# EAGLE schematic RT5350F_OLinuXino_Rev_B (EAGLE 4.16)
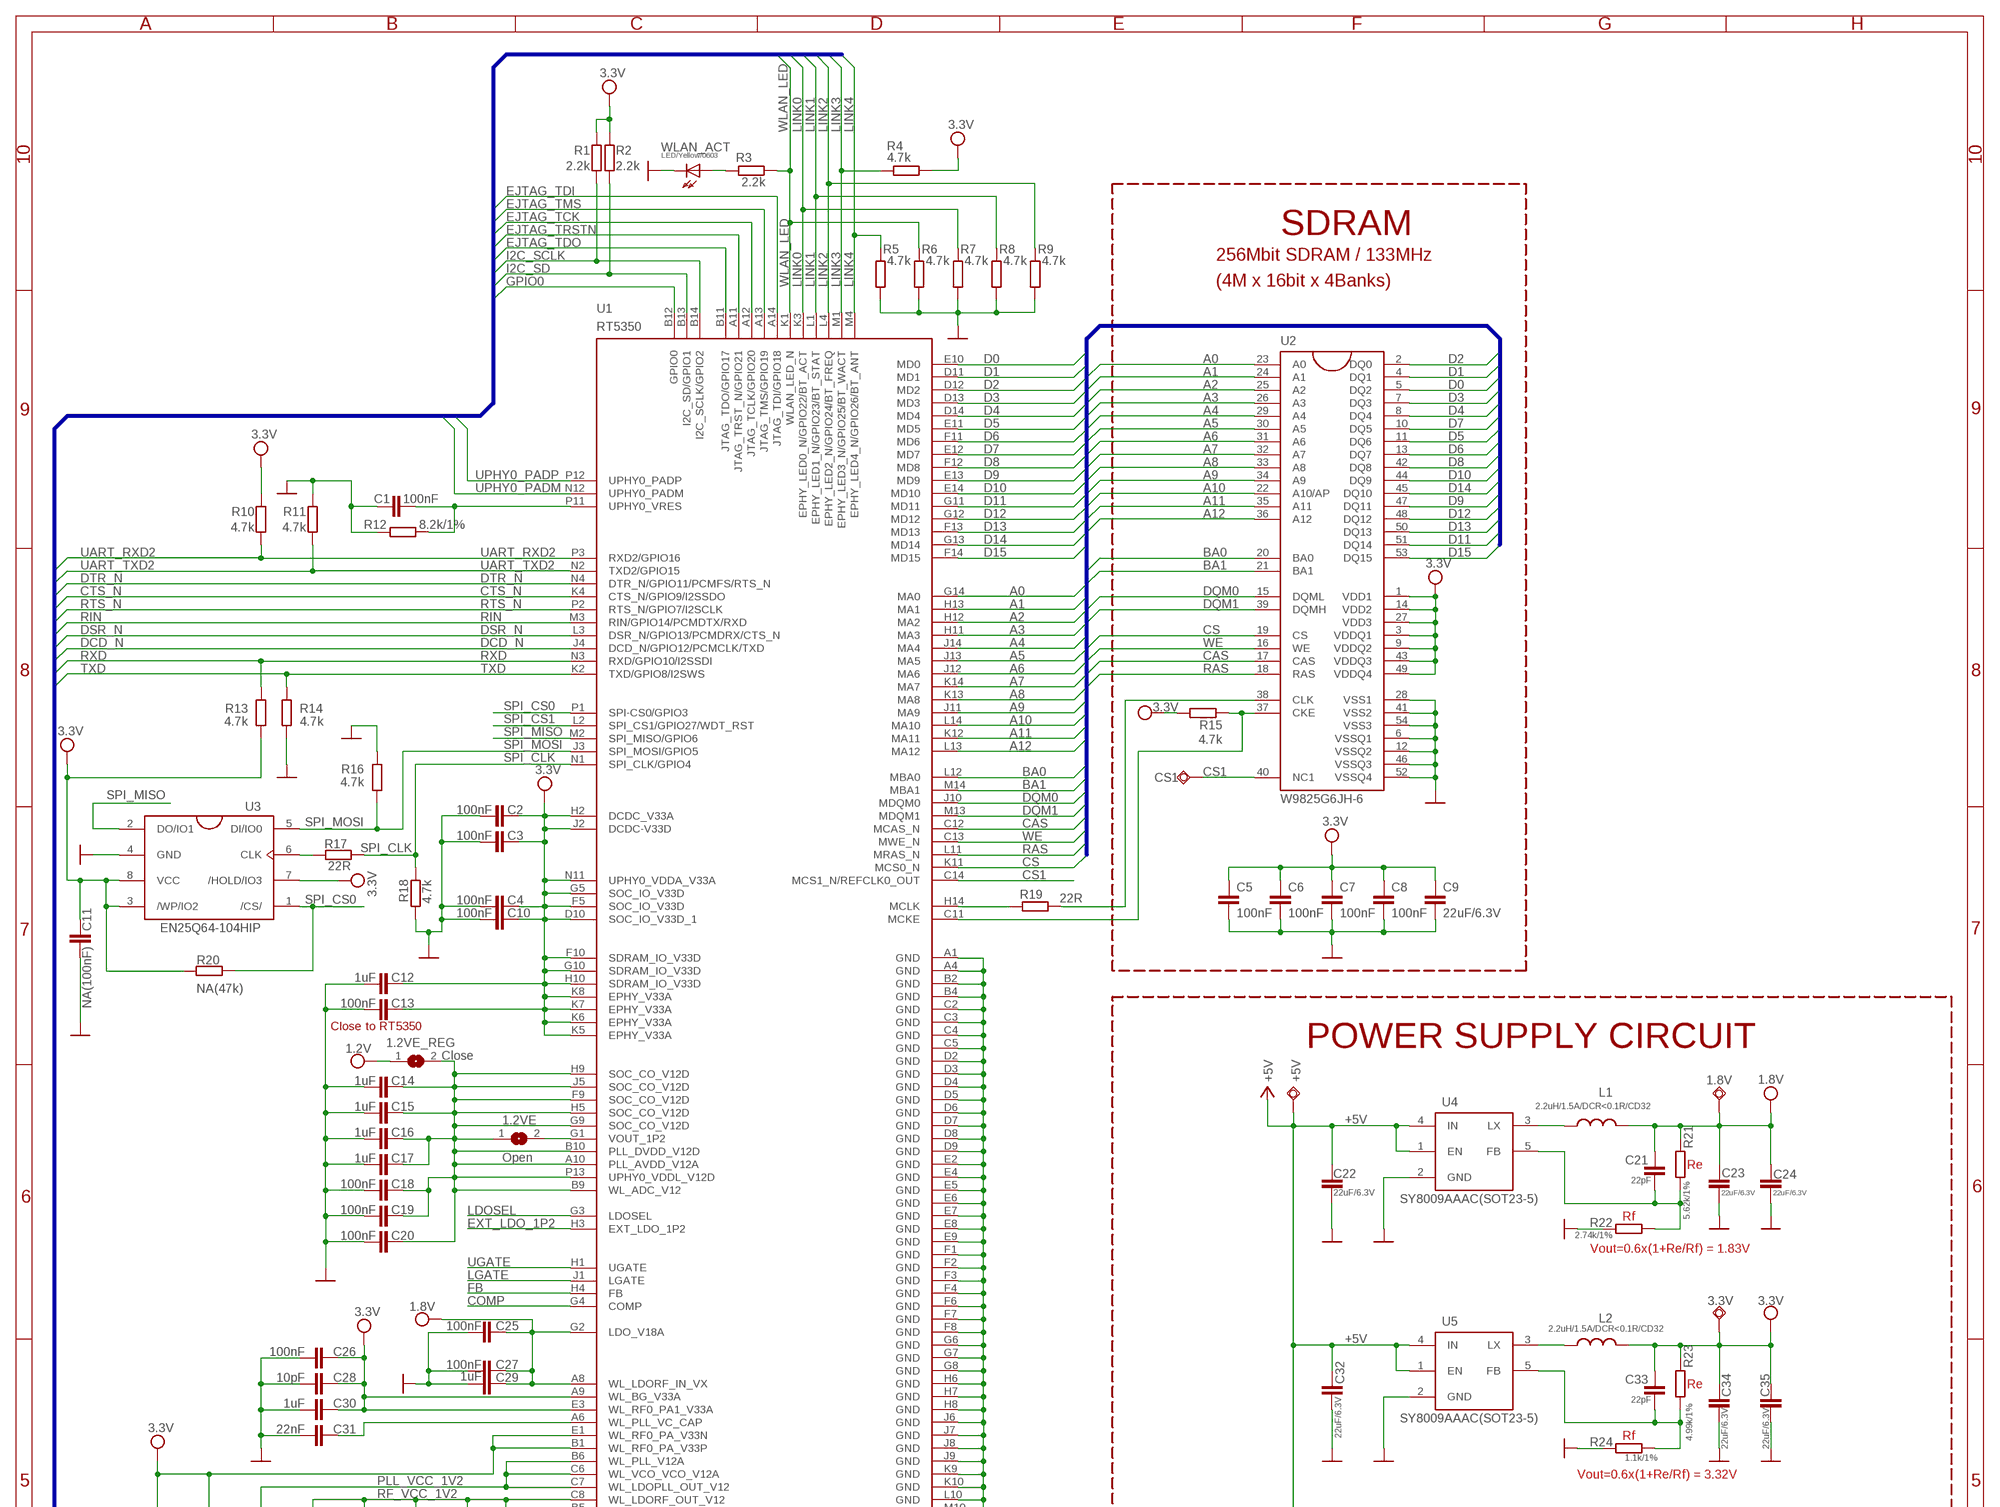
[diagram p0: schematic, sheet 1, part 1 of 2]
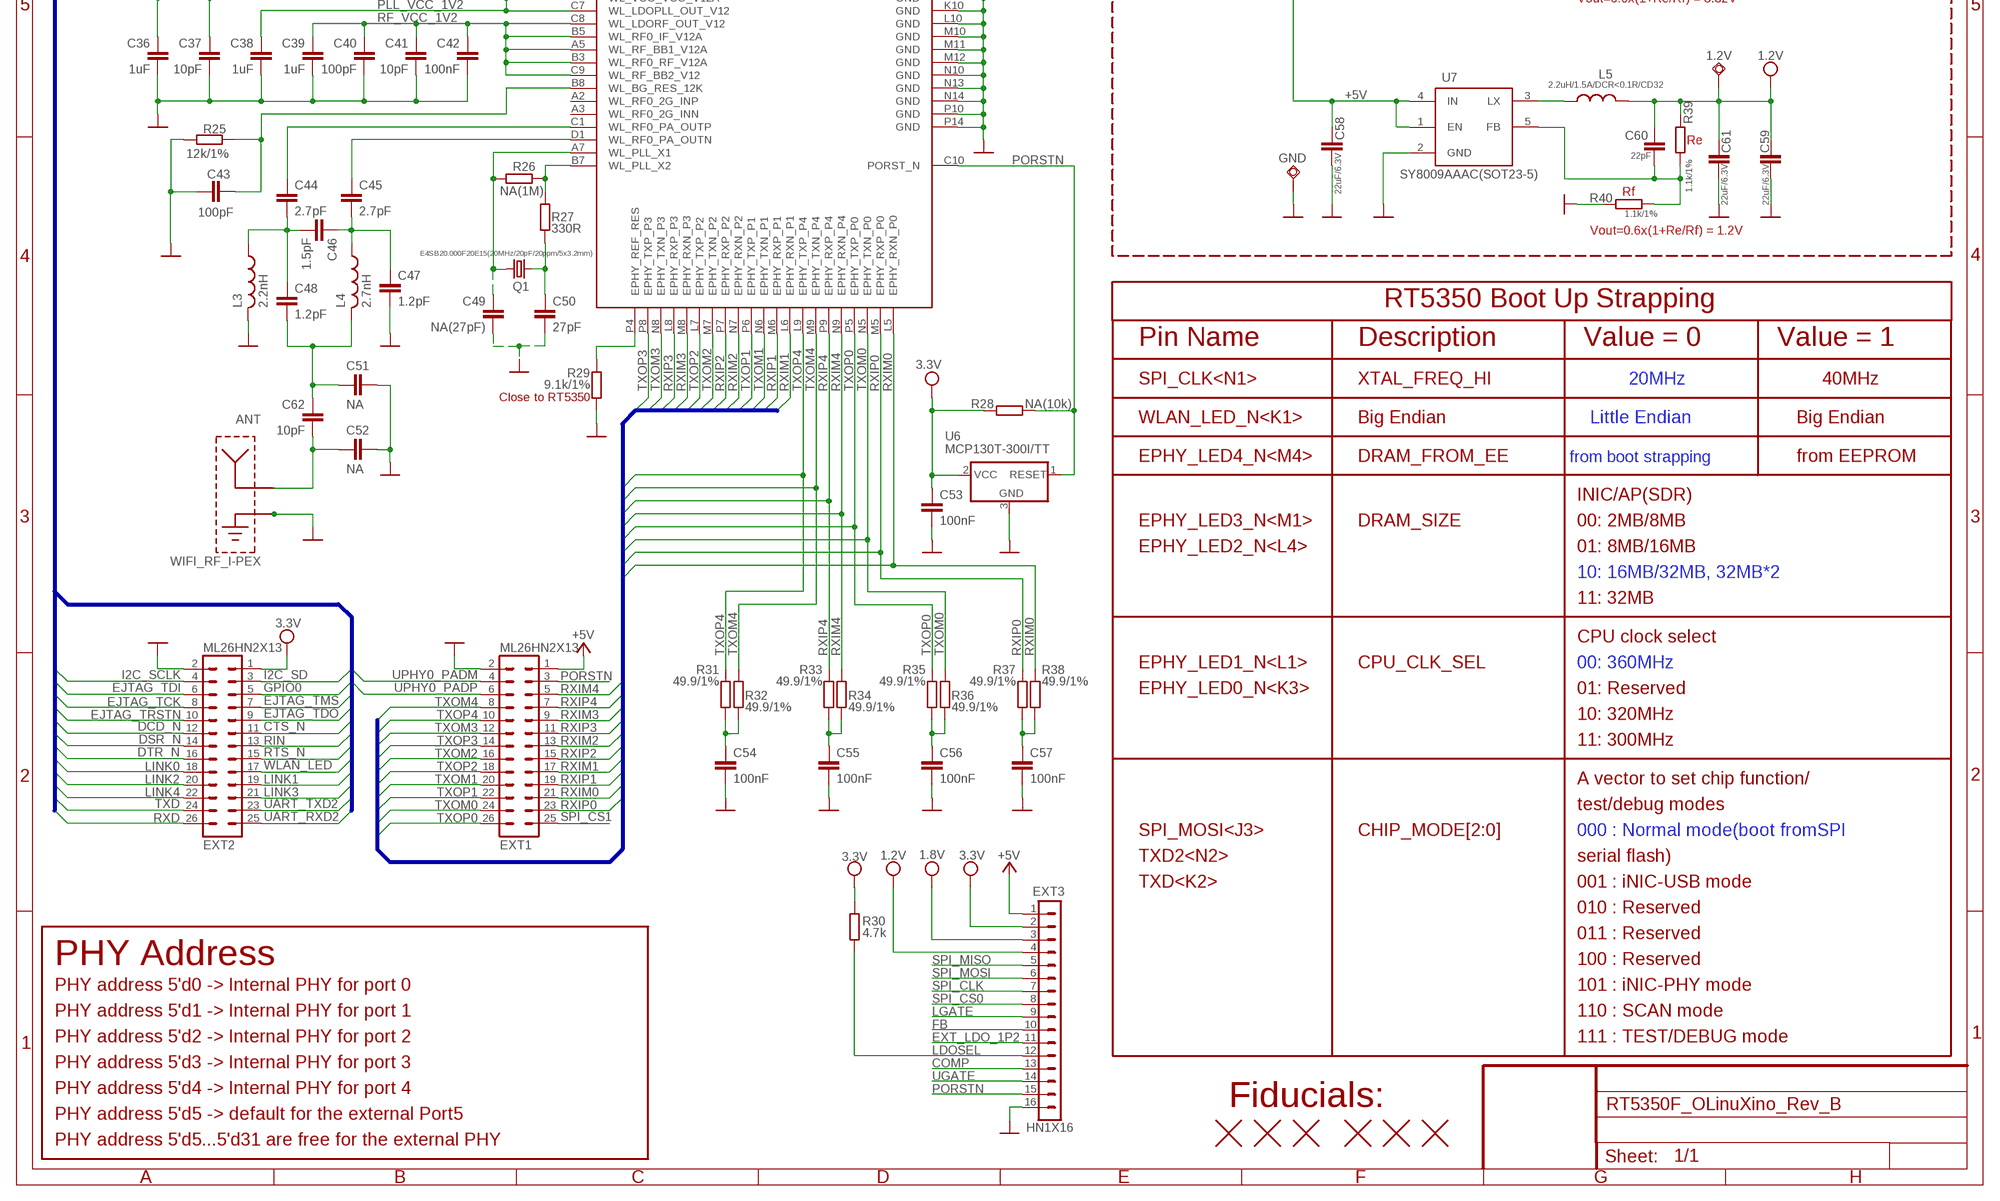
[diagram p1: schematic, sheet 1, part 2 of 2]

## Parts
1.2V  TESTPADTESTPAD_40-ROUND  [TESTPAD_40-ROUND]
1.2VE  Open  SJ_SMALLER  [SJ_1_SMALLER]
1.2VE_REG  Close  SJ_SMALLER  [SJ_1_SMALLER]
1.8V  TESTPADTESTPAD_40-ROUND  [TESTPAD_40-ROUND]
3.3V  3.3V  TESTPADTESTPAD_40-ROUND  [TESTPAD_40-ROUND]
+5V  TESTPADTESTPAD_40-ROUND  [TESTPAD_40-ROUND]
ANT  WIFI_RF_I-PEX  [WIFI_RF]
C1  100nF  C-EUC0402_TI  [C0402_TI]
C2  100nF  C-EUC0402_TI  [C0402_TI]
C3  100nF  C-EUC0402_TI  [C0402_TI]
C4  100nF  C-EUC0402_TI  [C0402_TI]
C5  100nF  C-EUC0402_TI  [C0402_TI]
C6  100nF  C-EUC0402_TI  [C0402_TI]
C7  100nF  C-EUC0402_TI  [C0402_TI]
C8  100nF  C-EUC0402_TI  [C0402_TI]
C9  22uF/6.3V  C-EUC0603_DWS  [C0603_DWS]
C10  100nF  C-EUC0402_TI  [C0402_TI]
C11  NA(100nF)  C-EUC0402_TI  [C0402_TI]
C12  1uF  C-EUC0603_DWS  [C0603_DWS]
C13  100nF  C-EUC0402_TI  [C0402_TI]
C14  1uF  C-EUC0603_DWS  [C0603_DWS]
C15  1uF  C-EUC0603_DWS  [C0603_DWS]
C16  1uF  C-EUC0603_DWS  [C0603_DWS]
C17  1uF  C-EUC0603_DWS  [C0603_DWS]
C18  100nF  C-EUC0402_TI  [C0402_TI]
C19  100nF  C-EUC0402_TI  [C0402_TI]
C20  100nF  C-EUC0402_TI  [C0402_TI]
C21  22pF  C-EUC0603_DWS  [C0603_DWS]
C22  22uF/6.3V  C-EUC0603_DWS  [C0603_DWS]
C23  22uF/6.3V  C-EUC0603_DWS  [C0603_DWS]
C24  22uF/6.3V  C-EUC0603_DWS  [C0603_DWS]
C25  100nF  C-EUC0402_TI  [C0402_TI]
C26  100nF  C-EUC0402_TI  [C0402_TI]
C27  100nF  C-EUC0402_TI  [C0402_TI]
C28  10pF  C-EUC0402_TI  [C0402_TI]
C29  1uF  C-EUC0603_DWS  [C0603_DWS]
C30  1uF  C-EUC0603_DWS  [C0603_DWS]
C31  22nF  C-EUC0402_TI  [C0402_TI]
C32  22uF/6.3V  C-EUC0603_DWS  [C0603_DWS]
C33  22pF  C-EUC0603_DWS  [C0603_DWS]
C34  22uF/6.3V  C-EUC0603_DWS  [C0603_DWS]
C35  22uF/6.3V  C-EUC0603_DWS  [C0603_DWS]
C36  1uF  C-EUC0603_DWS  [C0603_DWS]
C37  10pF  C-EUC0402_TI  [C0402_TI]
C38  1uF  C-EUC0603_DWS  [C0603_DWS]
C39  1uF  C-EUC0603_DWS  [C0603_DWS]
C40  100pF  C-EUC0402_TI  [C0402_TI]
C41  10pF  C-EUC0402_TI  [C0402_TI]
C42  100nF  C-EUC0402_TI  [C0402_TI]
C43  100pF  C-EUC0402_TI  [C0402_TI]
C44  2.7pF  C-EUC0402_TI  [C0402_TI]
C45  2.7pF  C-EUC0402_TI  [C0402_TI]
C46  1.5pF  C-EUC0402_TI  [C0402_TI]
C47  1.2pF  C-EUC0402_TI  [C0402_TI]
C48  1.2pF  C-EUC0402_TI  [C0402_TI]
C49  NA(27pF)  C-EUC0603_DWS  [C0603_DWS]
C50  27pF  C-EUC0603_DWS  [C0603_DWS]
C51  NA  C-EUC0402_TI  [C0402_TI]
C52  NA  C-EUC0402_TI  [C0402_TI]
C53  100nF  C-EUC0402_TI  [C0402_TI]
C54  100nF  C-EUC0402_TI  [C0402_TI]
C55  100nF  C-EUC0402_TI  [C0402_TI]
C56  100nF  C-EUC0402_TI  [C0402_TI]
C57  100nF  C-EUC0402_TI  [C0402_TI]
C58  22uF/6.3V  C-EUC0603_DWS  [C0603_DWS]
C59  22uF/6.3V  C-EUC0603_DWS  [C0603_DWS]
C60  22pF  C-EUC0603_DWS  [C0603_DWS]
C61  22uF/6.3V  C-EUC0603_DWS  [C0603_DWS]
C62  10pF  C-EUC0402_TI  [C0402_TI]
CS1  TESTPADTESTPAD30/30  [TESTPAD_30-ROUND]
EXT1  ML26HN2X13  [HN2X13-MALE]
EXT2  ML26HN2X13  [HN2X13-MALE]
EXT3  HN1X16  CON16-HN1X16  [HN1X16]
FID1  FIDUCIAL  [FIDUCIAL-1X3]
FID2  FIDUCIAL  [FIDUCIAL-1X3]
FID3  FIDUCIAL  [FIDUCIAL-1X3]
FID4  FIDUCIAL  [FIDUCIAL-1X3]
FID5  FIDUCIAL  [FIDUCIAL-1X3]
FID6  FIDUCIAL  [FIDUCIAL-1X3]
GND  TESTPADTESTPAD_40-ROUND  [TESTPAD_40-ROUND]
L1  2.2uH/1.5A/DCR<0.1R/CD32  L-CD32  [CD32]
L2  2.2uH/1.5A/DCR<0.1R/CD32  L-CD32  [CD32]
L3  2.2nH  L-USL0603_5MIL_DWS  [L0603_5MIL_DWS]
L4  2.7nH  L-USL0402_TI  [L0402_TI]
L5  2.2uH/1.5A/DCR<0.1R/CD32  L-CD32  [CD32]
Q1  E4SB20.000F20E15(20MHz/20pF/20ppm/5x3.2mm)  HC49/S_E4SB25.000F20E15  [HCX-4S]
R1  2.2k  R-EU_R0603_5MIL_DWS  [R0603_5MIL_DWS]
R2  2.2k  R-EU_R0603_5MIL_DWS  [R0603_5MIL_DWS]
R3  2.2k  R-EU_R0603_5MIL_DWS  [R0603_5MIL_DWS]
R4  4.7k  R-EU_R0603_5MIL_DWS  [R0603_5MIL_DWS]
R5  4.7k  R-EU_R0603_5MIL_DWS  [R0603_5MIL_DWS]
R6  4.7k  R-EU_R0603_5MIL_DWS  [R0603_5MIL_DWS]
R7  4.7k  R-EU_R0603_5MIL_DWS  [R0603_5MIL_DWS]
R8  4.7k  R-EU_R0603_5MIL_DWS  [R0603_5MIL_DWS]
R9  4.7k  R-EU_R0603_5MIL_DWS  [R0603_5MIL_DWS]
R10  4.7k  R-EU_R0603_5MIL_DWS  [R0603_5MIL_DWS]
R11  4.7k  R-EU_R0603_5MIL_DWS  [R0603_5MIL_DWS]
R12  8.2k/1%  R-EU_R0603_5MIL_DWS  [R0603_5MIL_DWS]
R13  4.7k  R-EU_R0603_5MIL_DWS  [R0603_5MIL_DWS]
R14  4.7k  R-EU_R0603_5MIL_DWS  [R0603_5MIL_DWS]
R15  4.7k  R-EU_R0603_5MIL_DWS  [R0603_5MIL_DWS]
R16  4.7k  R-EU_R0603_5MIL_DWS  [R0603_5MIL_DWS]
R17  22R  R-EU_R0603_5MIL_DWS  [R0603_5MIL_DWS]
R18  4.7k  R-EU_R0603_5MIL_DWS  [R0603_5MIL_DWS]
R19  22R  R-EU_R0603_5MIL_DWS  [R0603_5MIL_DWS]
R20  NA(47k)  R-EU_R0603_5MIL_DWS  [R0603_5MIL_DWS]
R21  5.62k/1%  R-EU_R0603_5MIL_DWS  [R0603_5MIL_DWS]
R22  2.74k/1%  R-EU_R0603_5MIL_DWS  [R0603_5MIL_DWS]
R23  4.99k/1%  R-EU_R0603_5MIL_DWS  [R0603_5MIL_DWS]
R24  1.1k/1%  R-EU_R0603_5MIL_DWS  [R0603_5MIL_DWS]
R25  12k/1%  R-EU_R0402_TI  [R0402_TI]
R26  NA(1M)  R-EU_R0603_5MIL_DWS  [R0603_5MIL_DWS]
R27  330R  R-EU_R0603_5MIL_DWS  [R0603_5MIL_DWS]
R28  NA(10k)  R-EU_R0603_5MIL_DWS  [R0603_5MIL_DWS]
R29  9.1k/1%  R-EU_R0603_5MIL_DWS  [R0603_5MIL_DWS]
R30  4.7k  R-EU_R0603_5MIL_DWS  [R0603_5MIL_DWS]
R31  49.9/1%  R-EU_R0603_5MIL_DWS  [R0603_5MIL_DWS]
R32  49.9/1%  R-EU_R0603_5MIL_DWS  [R0603_5MIL_DWS]
R33  49.9/1%  R-EU_R0603_5MIL_DWS  [R0603_5MIL_DWS]
R34  49.9/1%  R-EU_R0603_5MIL_DWS  [R0603_5MIL_DWS]
R35  49.9/1%  R-EU_R0603_5MIL_DWS  [R0603_5MIL_DWS]
R36  49.9/1%  R-EU_R0603_5MIL_DWS  [R0603_5MIL_DWS]
R37  49.9/1%  R-EU_R0603_5MIL_DWS  [R0603_5MIL_DWS]
R38  49.9/1%  R-EU_R0603_5MIL_DWS  [R0603_5MIL_DWS]
R39  1.1k/1%  R-EU_R0603_5MIL_DWS  [R0603_5MIL_DWS]
R40  1.1k/1%  R-EU_R0603_5MIL_DWS  [R0603_5MIL_DWS]
U1  RT5350  [TFBGA196B]
U2  W9825G6JH-6  K4S561632C-TC/L75  [54TSOPII]
U3  EN25Q64-104HIP  W25Q16BVSSIG  [SO8_ATMEL_FLASH]
U4  SY8009AAAC(SOT23-5)  SY8008  [SOT23-5]
U5  SY8009AAAC(SOT23-5)  SY8008  [SOT23-5]
U6  MCP130T-300I/TT  RESETMCP130T-300-I/TT  [SOT23]
U7  SY8009AAAC(SOT23-5)  SY8008  [SOT23-5]
WLAN_ACT  LED/Yellow/0603  LED0603DWS  [LED-0603]

## Nets
1.2V: 1.2VE.1 1.2VE_REG.2 C14.1 C15.1 C16.1 C17.1 C18.1 C19.1 C20.1 U1.A10(PLL_AVDD_V12A) U1.B9(WL_ADC_V12) U1.B10(PLL_DVDD_V12D) U1.F9(SOC_CO_V12D) U1.G9(SOC_CO_V12D) U1.H5(SOC_CO_V12D) U1.H9(SOC_CO_V12D) U1.J5(SOC_CO_V12D) U1.P13(UPHY0_VDDL_V12D)
+5V: +5V.1(PP) C22.1 C32.1 C58.1 EXT1.1 EXT3.1 U4.1(EN) U4.4(IN) U5.1(EN) U5.4(IN) U7.1(EN) U7.4(IN)
A0: U1.G14(MA0) U2.23(A0)
A1: U1.H13(MA1) U2.24(A1)
A2: U1.H12(MA2) U2.25(A2)
A3: U1.H11(MA3) U2.26(A3)
A4: U1.J14(MA4) U2.29(A4)
A5: U1.J13(MA5) U2.30(A5)
A6: U1.J12(MA6) U2.31(A6)
A7: U1.K14(MA7) U2.32(A7)
A8: U1.K13(MA8) U2.33(A8)
A9: U1.J11(MA9) U2.34(A9)
A10: U1.L14(MA10) U2.22(A10/AP)
A11: U1.K12(MA11) U2.35(A11)
A12: U1.L13(MA12) U2.36(A12)
BA0: U1.L12(MBA0) U2.20(BA0)
BA1: U1.M14(MBA1) U2.21(BA1)
CAS: U1.C12(MCAS_N) U2.17(CAS)
COMP: EXT3.13 U1.G4(COMP)
CS: U1.K11(MCS0_N) U2.19(CS)
CS1: CS1.1(PP) U1.C14(MCS1_N/REFCLK0_OUT) U2.40(NC1)
CTS_N: EXT2.11 U1.K4(CTS_N/GPIO9/I2SSDO)
D0: U1.E10(MD0) U2.5(DQ2)
D1: U1.D11(MD1) U2.4(DQ1)
D2: U1.D12(MD2) U2.2(DQ0)
D3: U1.D13(MD3) U2.7(DQ3)
D4: U1.D14(MD4) U2.8(DQ4)
D5: U1.E11(MD5) U2.11(DQ6)
D6: U1.F11(MD6) U2.13(DQ7)
D7: U1.E12(MD7) U2.10(DQ5)
D8: U1.F12(MD8) U2.42(DQ8)
D9: U1.E13(MD9) U2.47(DQ11)
D10: U1.E14(MD10) U2.44(DQ9)
D11: U1.G11(MD11) U2.51(DQ14)
D12: U1.G12(MD12) U2.48(DQ12)
D13: U1.F13(MD13) U2.50(DQ13)
D14: U1.G13(MD14) U2.45(DQ10)
D15: U1.F14(MD15) U2.53(DQ15)
DCD_N: EXT2.12 U1.J4(DCD_N/GPIO12/PCMCLK/TXD)
DQM0: U1.J10(MDQM0) U2.15(DQML)
DQM1: U1.M13(MDQM1) U2.39(DQMH)
DSR_N: EXT2.14 U1.L3(DSR_N/GPIO13/PCMDRX/CTS_N)
DTR_N: EXT2.16 U1.N4(DTR_N/GPIO11/PCMFS/RTS_N)
EJTAG_TCK: EXT2.8 U1.A12(JTAG_TCLK/GPIO20)
EJTAG_TDI: EXT2.6 U1.A14(JTAG_TDI/GPIO18)
EJTAG_TDO: EXT2.9 U1.B11(JTAG_TDO/GPIO17)
EJTAG_TMS: EXT2.7 U1.A13(JTAG_TMS/GPIO19)
EJTAG_TRSTN: EXT2.10 U1.A11(JTAG_TRST_N/GPIO21)
EXT_LDO_1P2: EXT3.11 U1.H3(EXT_LDO_1P2)
FB: EXT3.10 U1.H4(FB)
GND: ANT.GND1(GND_1) ANT.GND2(GND_2) C1.2 C2.2 C3.2 C4.2 C5.2 C6.2 C7.2 C8.2 C9.2 C10.2 C11.2 C12.2 C13.2 C14.2 C15.2 C16.2 C17.2 C18.2 C19.2 C20.2 C22.2 C23.2 C24.2 C25.2 C26.2 C27.2 C28.2 C29.2 C30.2 C31.2 C32.2 C34.2 C35.2 C36.2 C37.2 C38.2 C39.2 C40.2 C41.2 C42.2 C43.2 C47.2 C49.2 C50.2 C51.2 C52.2 C53.2 C54.2 C55.2 C56.2 C57.2 C58.2 C59.2 C61.2 EXT1.2 EXT2.2 EXT3.16 GND.1(PP) L3.2 R5.2 R6.2 R7.2 R8.2 R9.2 R11.2 R12.2 R14.2 R16.1 R18.2 R22.2 R24.2 R25.1 R29.2 R40.2 U1.A1(GND) U1.A4(GND) U1.B2(GND) U1.B4(GND) U1.C2(GND) U1.C3(GND) U1.C4(GND) U1.C5(GND) U1.D2(GND) U1.D3(GND) U1.D4(GND) U1.D5(GND) U1.D6(GND) U1.D7(GND) U1.D8(GND) U1.D9(GND) U1.E2(GND) U1.E4(GND) U1.E5(GND) U1.E6(GND) U1.E7(GND) U1.E8(GND) U1.E9(GND) U1.F1(GND) U1.F2(GND) U1.F3(GND) U1.F4(GND) U1.F6(GND) U1.F7(GND) U1.F8(GND) U1.G6(GND) U1.G7(GND) U1.G8(GND) U1.H6(GND) U1.H7(GND) U1.H8(GND) U1.J6(GND) U1.J7(GND) U1.J8(GND) U1.J9(GND) U1.K9(GND) U1.K10(GND) U1.L10(GND) U1.M10(GND) U1.M11(GND) U1.M12(GND) U1.N10(GND) U1.N13(GND) U1.N14(GND) U1.P10(GND) U1.P14(GND) U2.6(VSSQ1) U2.12(VSSQ2) U2.28(VSS1) U2.41(VSS2) U2.46(VSSQ3) U2.52(VSSQ4) U2.54(VSS3) U3.4(GND) U4.2(GND) U5.2(GND) U6.3(GND) U7.2(GND) WLAN_ACT.C
GPIO0: EXT2.5 U1.B12(GPIO0)
I2C_SCLK: EXT2.4 R1.1 U1.B14(I2C_SCLK/GPIO2)
I2C_SD: EXT2.3 R2.1 U1.B13(I2C_SD/GPIO1)
LDOSEL: EXT3.12 R30.1 U1.G3(LDOSEL)
LGATE: EXT3.9 U1.J1(LGATE)
LINK0: EXT2.18 R7.1 U1.K3(EPHY_LED0_N/GPIO22/BT_ACT)
LINK1: EXT2.19 R8.1 U1.L1(EPHY_LED1_N/GPIO23/BT_STAT)
LINK2: EXT2.20 R9.1 U1.L4(EPHY_LED2_N/GPIO24/BT_FREQ)
LINK3: EXT2.21 R4.1 U1.M1(EPHY_LED3_N/GPIO25/BT_WACT)
LINK4: EXT2.22 R5.1 U1.M4(EPHY_LED4_N/GPIO26/BT_ANT)
N$1: R17.1 U3.6(CLK)
N$2: C43.1 R25.2 U1.B8(WL_BG_RES_12K)
N$3: C44.1 U1.C1(WL_RF0_PA_OUTP)
N$4: C45.1 U1.D1(WL_RF0_PA_OUTN)
N$5: C44.2 C46.2 C48.1 L3.1
N$6: C45.2 C46.1 C47.1 L4.1
N$7: C48.2 C51.1 C62.1 L4.2
N$8: R26.2 R27.1 U1.B7(WL_PLL_X2)
N$9: C50.1 Q1.1 R27.2
N$10: C49.1 Q1.2 R26.1 U1.A7(WL_PLL_X1)
N$11: R29.1 U1.P4(EPHY_REF_RES)
N$12: C54.1 R31.2 R32.2
N$13: C55.1 R33.2 R34.2
N$14: C56.1 R35.2 R36.2
N$15: C57.1 R37.2 R38.2
N$18: R19.1 U1.H14(MCLK)
N$19: R19.2 U2.38(CLK)
N$21: L5.1 U7.3(LX)
N$22: C60.2 R39.2 R40.1 U7.5(FB)
N$23: L1.1 U4.3(LX)
N$24: C21.2 R21.2 R22.1 U4.5(FB)
N$26: ANT.ANT C52.1 C62.2
N$27: R15.2 U1.C11(MCKE) U2.37(CKE)
N$35: R3.1 WLAN_ACT.A
N$57: C31.1 U1.A6(WL_PLL_VC_CAP)
N$64: L2.1 U5.3(LX)
N$66: C33.2 R23.2 R24.1 U5.5(FB)
PLL_VCC_1V2: C38.1 U1.B6(WL_PLL_V12A) U1.C6(WL_VCO_VCO_V12A) U1.C7(WL_LDOPLL_OUT_V12)
PORSTN: EXT1.3 EXT3.15 R28.2 U1.C10(PORST_N) U6.1(RESET)
RAS: U1.L11(MRAS_N) U2.18(RAS)
RF_VCC_1V2: C39.1 C40.1 C41.1 C42.1 U1.A5(WL_RF_BB1_V12A) U1.B3(WL_RF0_RF_V12A) U1.B5(WL_RF0_IF_V12A) U1.C8(WL_LDORF_OUT_V12) U1.C9(WL_RF_BB2_V12)
RIN: EXT2.13 U1.M3(RIN/GPIO14/PCMDTX/RXD)
RTS_N: EXT2.15 U1.P2(RTS_N/GPIO7/I2SCLK)
RXD: EXT2.26 R13.1 U1.N3(RXD/GPIO10/I2SSDI)
RXIM0: EXT1.21 R38.1 U1.L5(EPHY_RXN_P0)
RXIM1: EXT1.17 U1.L6(EPHY_RXN_P1)
RXIM2: EXT1.13 U1.N7(EPHY_RXN_P2)
RXIM3: EXT1.9 U1.M8(EPHY_RXN_P3)
RXIM4: EXT1.5 R34.1 U1.N9(EPHY_RXN_P4)
RXIP0: EXT1.23 R37.1 U1.M5(EPHY_RXP_P0)
RXIP1: EXT1.19 U1.M6(EPHY_RXP_P1)
RXIP2: EXT1.15 U1.P7(EPHY_RXP_P2)
RXIP3: EXT1.11 U1.L8(EPHY_RXP_P3)
RXIP4: EXT1.7 R33.1 U1.P9(EPHY_RXP_P4)
SPI_CLK: EXT3.7 R17.2 R18.1 U1.N1(SPI_CLK/GPIO4)
SPI_CS0: EXT3.8 R20.2 U1.P1(SPI-CS0/GPIO3) U3.1(/CS/)
SPI_CS1: EXT1.25 U1.L2(SPI_CS1/GPIO27/WDT_RST)
SPI_MISO: EXT3.5 U1.M2(SPI_MISO/GPIO6) U3.2(DO/IO1)
SPI_MOSI: EXT3.6 R16.2 U1.J3(SPI_MOSI/GPIO5) U3.5(DI/IO0)
TXD: EXT2.24 R14.1 U1.K2(TXD/GPIO8/I2SWS)
TXOM0: EXT1.24 R36.1 U1.N5(EPHY_TXN_P0)
TXOM1: EXT1.20 U1.N6(EPHY_TXN_P1)
TXOM2: EXT1.16 U1.M7(EPHY_TXN_P2)
TXOM3: EXT1.12 U1.N8(EPHY_TXN_P3)
TXOM4: EXT1.8 R32.1 U1.M9(EPHY_TXN_P4)
TXOP0: EXT1.26 R35.1 U1.P5(EPHY_TXP_P0)
TXOP1: EXT1.22 U1.P6(EPHY_TXP_P1)
TXOP2: EXT1.18 U1.L7(EPHY_TXP_P2)
TXOP3: EXT1.14 U1.P8(EPHY_TXP_P3)
TXOP4: EXT1.10 R31.1 U1.L9(EPHY_TXP_P4)
UART_RXD2: EXT2.25 R10.1 U1.P3(RXD2/GPIO16)
UART_TXD2: EXT2.23 R11.1 U1.N2(TXD2/GPIO15)
UGATE: EXT3.14 U1.H1(UGATE)
UPHY0_PADM: EXT1.4 U1.N12(UPHY0_PADM)
UPHY0_PADP: EXT1.6 U1.P12(UPHY0_PADP)
UPHY0_VRES: C1.1 R12.1 U1.P11(UPHY0_VRES)
VCC: 3.3V.1(PP) C2.1 C3.1 C4.1 C5.1 C6.1 C7.1 C8.1 C9.1 C10.1 C11.1 C12.1 C13.1 C26.1 C28.1 C30.1 C33.1 C34.1 C35.1 C36.1 C37.1 C53.1 EXT2.1 EXT3.2 L2.2 R1.2 R2.2 R4.2 R10.2 R13.2 R15.1 R20.1 R23.1 R28.1 R30.2 U1.A9(WL_BG_V33A) U1.B1(WL_RF0_PA_V33P) U1.D10(SOC_IO_V33D_1) U1.E1(WL_RF0_PA_V33N) U1.E3(WL_RF0_PA1_V33A) U1.F5(SOC_IO_V33D) U1.F10(SDRAM_IO_V33D) U1.G5(SOC_IO_V33D) U1.G10(SDRAM_IO_V33D) U1.H2(DCDC_V33A) U1.H10(SDRAM_IO_V33D) U1.J2(DCDC-V33D) U1.K5(EPHY_V33A) U1.K6(EPHY_V33A) U1.K7(EPHY_V33A) U1.K8(EPHY_V33A) U1.N11(UPHY0_VDDA_V33A) U2.1(VDD1) U2.3(VDDQ1) U2.9(VDDQ2) U2.14(VDD2) U2.27(VDD3) U2.43(VDDQ3) U2.49(VDDQ4) U3.3(/WP/IO2) U3.7(/HOLD/IO3) U3.8(VCC) U6.2(VCC) ; supply symbol labelled 3.3V
VEE: 1.2V.1(PP) 1.2VE_REG.1 C59.1 C60.1 C61.1 EXT3.4 L5.2 R39.1 ; supply symbol labelled 1.2V
VOUT_1P2: 1.2VE.2 U1.G1(VOUT_1P2)
VPP: 1.8V.1(PP) C21.1 C23.1 C24.1 C25.1 C27.1 C29.1 EXT3.3 L1.2 R21.1 U1.A8(WL_LDORF_IN_VX) U1.G2(LDO_V18A) ; supply symbol labelled 1.8V
WE: U1.C13(MWE_N) U2.16(WE)
WLAN_LED: EXT2.17 R3.2 R6.1 U1.K1(WLAN_LED_N)
Unconnected: U1.A2(WL_RF0_2G_INP) U1.A3(WL_RF0_2G_INN)

## Buses
D[0..15],A[0..12],BA[0..1],CAS,CS,DQM[0..1],RAS,WE
LINK4,LINK3,LINK2,LINK1,LINK0,WLAN_LED,EJTAG_TDI,EJTAG_TMS,EJTAG_TCK,EJTAG_TRSTN,EJTAG_TDO,I2C_SCLK,I2C_SD,GPIO0,UART_RXD2,UART_TXD2,DTR_N,CTS_N,RTS_N,RIN,DSR_N,DCD_N,RXD,TXD,UPHY0_PADM,UPHY0_PADP
TXOP3,TXOM3,RXIP3,RXIM3,TXOP2,TXOM2,RXIP2,RXIM2,TXOP1,TXOM1,RXIP1,RXIM1,TXOP4,TXOM4,RXIP4,RXIM4,TXOP0,TXOM0,RXIP0,RXIM0

## Notes on the sheet
- SDRAM
- 256Mbit SDRAM / 133MHz
- (4M x 16bit x 4Banks)
- Close to RT5350
- POWER SUPPLY CIRCUIT
- Re
- Rf
- Vout=0.6x(1+Re/Rf) = 1.83V
- Re
- Rf
- Vout=0.6x(1+Re/Rf) = 3.32V
- Re
- Rf
- Vout=0.6x(1+Re/Rf) = 1.2V
- RT5350 Boot Up Strapping
- Pin Name | Description | Value = 0 | Value = 1
- SPI_CLK<N1> | XTAL_FREQ_HI | 20MHz | 40MHz
- Close to RT5350
- WLAN_LED_N<K1> | Big Endian | Little Endian | Big Endian
- EPHY_LED4_N<M4> | DRAM_FROM_EE | from boot strapping | from EEPROM
- INIC/AP(SDR)
- EPHY_LED3_N<M1> | DRAM_SIZE | 00: 2MB/8MB
- EPHY_LED2_N<L4> | 01: 8MB/16MB
- 10: 16MB/32MB, 32MB*2
- 11: 32MB
- CPU clock select
- EPHY_LED1_N<L1> | CPU_CLK_SEL | 00: 360MHz
- EPHY_LED0_N<K3> | 01: Reserved
- 10: 320MHz
- 11: 300MHz
- A vector to set chip function/
- test/debug modes
- SPI_MOSI<J3> | CHIP_MODE[2:0] | 000 : Normal mode(boot fromSPI
- TXD2<N2> | serial flash)
- TXD<K2> | 001 : iNIC-USB mode
- 010 : Reserved
- 011 : Reserved
- PHY Address | 100 : Reserved
- PHY address 5'd0 -> Internal PHY for port 0
- 101 : iNIC-PHY mode
- PHY address 5'd1 -> Internal PHY for port 1
- 110 : SCAN mode
- PHY address 5'd2 -> Internal PHY for port 2
- 111 : TEST/DEBUG mode
- PHY address 5'd3 -> Internal PHY for port 3
- PHY address 5'd4 -> Internal PHY for port 4
- PHY address 5'd5 -> default for the external Port5 | Fiducials:
- PHY address 5'd5...5'd31 are free for the external PHY

## Library data of the parts
1.2V 1.8V 3.3V +5V CS1 GND = gogo:TESTPAD: drill 40mils, diameter 70mils
1.2VE 1.2VE_REG = jumper:SJ_SMALLER
ANT = OLIMEX_ANT:WIFI_RF_I-PEX
C1-C62 = rcl:C-EU: CAPACITOR, European symbol
EXT1 EXT2 = con-harting-ml:ML26: HARTING
EXT3 = Penko:CON16
FID1-FID6 = SparkFunEagle-6-6-07:FIDUCIAL: Fiducial Alignment Points Various fiducial points for machine vision alignment.
L1 L2 L5 = OLIMEX_DISCRET:L
L3 L4 = rcl:L-US: INDUCTOR, American symbol
Q1 = crystal:HC49/S: CRYSTAL
R1-R40 = rcl:R-EU_: RESISTOR, European symbol
U1 = OLIMEX_IC:RT5350: RT5350 SoC - combined Ralink's 802.11n compliant 1T1R MAC/BBP/RF, a high performance 360 MHz MIPS24KEc CPU core and USB controller/PHY
U2 = SIRRUS:K4S561632C-TC/L75
U3 = OLIMEX_IC:W25Q16BVSSIG
U4 U5 U7 = OLIMEX_IC:SY8008
U6 = gogo:RESET: Microcontroller Supervisory Circuit with Open Drain Output
WLAN_ACT = DOUBLE-SIDE:LED